# EAGLE design jnz-rev1 (EAGLE 7.5.0)
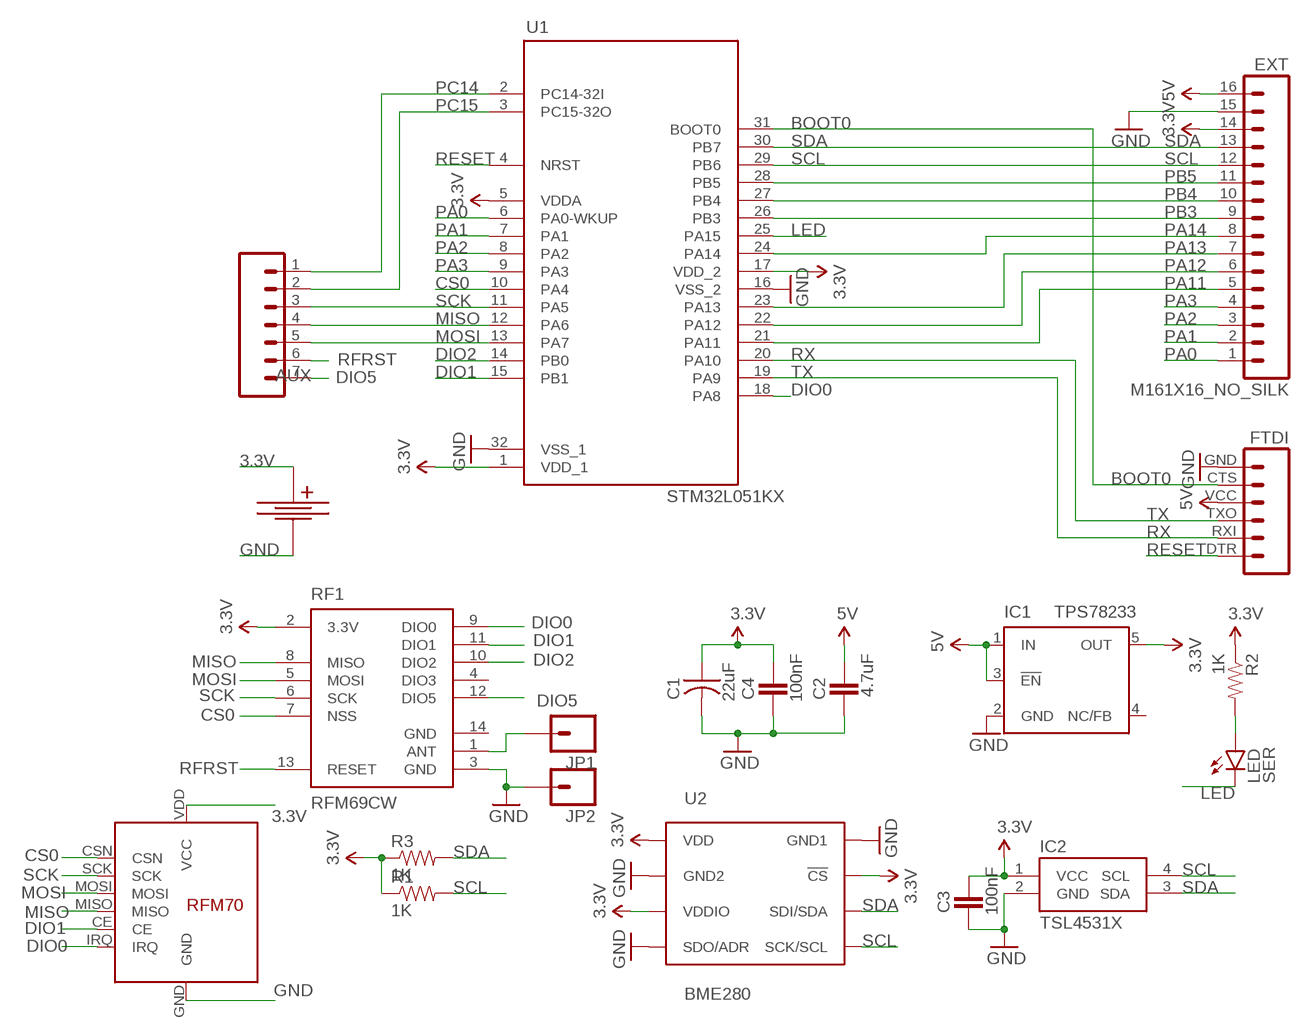
[diagram p0: schematic, sheet 1]

## Parts
AUX  M07  [1X07]
C1  22uF  C-USC0805  [C0805]
C2  4.7uF  C-EUC0805K  [C0805K]
C3  100nF  C-EUC0603K  [C0603K]
C4  100nF  C-EUC0603K  [C0603K]
EXT  M161X16_NO_SILK  [1X16_NO_SILK]
FTDI  FTDI_BASICPTH  [FTDI_BASIC]
IC1  TPS78233  TPS77001  [SOT23-DBV]
IC2  TSL4531X  [AMS_CL]
JP1  M01NOSILK-KIT  [1X01NS-KIT]
JP2  M01NOSILK-KIT  [1X01NS-KIT]
LED  SER  LED0603  [LED-0603]
R1  1K  RESISTOR0603-RES  [0603-RES]
R2  1K  RESISTOR0603-RES  [0603-RES]
R3  1K  RESISTOR0603-RES  [0603-RES]
RF1  RFM69CW  [RFM69CW-XXXS2]
RF2  RFM7x  RFM70  [RFM70]
U1  STM32L051KX  [TQFP32-08]
U2  BME280  [BME280_LGA]
U$2  CR2032-SMD  [CR2032-SMD]

## Nets
3.3V [power]: C1.1 C3.1 C4.1 EXT.14 IC1.5(OUT) IC2.1(VCC) R1.1 R2.1 R3.1 RF1.2(3.3V) RF2.VDD(VCC) U1.1(VDD_1) U1.5(VDDA) U1.17(VDD_2) U2.P$2(!CS) U2.P$6(VDDIO) U2.P$8(VDD) U$2.POS(+)
5V [power]: C2.1 EXT.16 FTDI.VCC IC1.1(IN) IC1.3(!EN)
BOOT0: FTDI.CTS U1.31(BOOT0)
CS0: RF1.7(NSS) RF2.CSN U1.10(PA4)
DIO0: RF1.9(DIO0) RF2.IRQ U1.18(PA8)
DIO1: RF1.11(DIO1) RF2.CE U1.15(PB1)
DIO2: RF1.10(DIO2) U1.14(PB0)
DIO5: AUX.7 RF1.12(DIO5)
GND [power]: C1.2 C2.2 C3.2 C4.2 EXT.15 FTDI.GND IC1.2(GND) IC2.2(GND) JP2.1 RF1.3(GND) RF2.GND U1.16(VSS_2) U1.32(VSS_1) U2.P$1(GND1) U2.P$5(SDO/ADR) U2.P$7(GND2) U$2.NEG(-)
LED: LED.C U1.25(PA15)
MISO: AUX.4 RF1.8(MISO) RF2.MISO U1.12(PA6)
MOSI: AUX.5 RF1.5(MOSI) RF2.MOSI U1.13(PA7)
N$2: LED.A R2.2
N$13: JP1.1 RF1.1(ANT)
PA0: EXT.1 U1.6(PA0-WKUP)
PA1: EXT.2 U1.7(PA1)
PA2: EXT.3 U1.8(PA2)
PA3: EXT.4 U1.9(PA3)
PA11: EXT.5 U1.21(PA11)
PA12: EXT.6 U1.22(PA12)
PA13: EXT.7 U1.23(PA13)
PA14: EXT.8 U1.24(PA14)
PB3: EXT.9 U1.26(PB3)
PB4: EXT.10 U1.27(PB4)
PB5: EXT.11 U1.28(PB5)
PC14: AUX.1 U1.2(PC14-32I)
PC15: AUX.2 U1.3(PC15-32O)
RESET: FTDI.DTR U1.4(NRST)
RFRST: AUX.6 RF1.13(RESET)
RX: FTDI.TXO U1.20(PA10)
SCK: AUX.3 RF1.6(SCK) RF2.SCK U1.11(PA5)
SCL: EXT.12 IC2.4(SCL) R1.2 U1.29(PB6) U2.P$4(SCK/SCL)
SDA: EXT.13 IC2.3(SDA) R3.2 U1.30(PB7) U2.P$3(SDI/SDA)
TX: FTDI.RXI U1.19(PA9)
Unconnected: IC1.4(NC/FB) RF1.4(DIO3)

## Power pins joined to a net without a drawn wire
GND: RF1.14(GND)

## Library data of the parts
AUX = SparkFun-Connectors:M07: Header 7 Standard 7-pin 0.1" header. Use with straight break away headers (SKU : PRT-00116), right angle break away headers (PRT-00553), swiss pins (PRT-00743), machine pins (PRT-00117), and female headers (PRT-00115). NOTES ON THE VARIANTS LOCK and LOCK_LONGPADS... This footprint was designed to help hold the alignment of a through-hole component (i.e. 7-pin header) while soldering it into place. You may notice that each hole has been shifted either up or down by 0.005 of an inch from it's more standard position (which is usually a perfectly straight line). This slight alteration caused the pins (the squares in the middle) to touch the edges of the holes. Because they are alternating, it causes a "brace" to hold the header in place. 0.005 has proven to be the perfect amount of "off-center" position when using our standard breakaway headers. Although looks a little odd when you look at the bare footprint, once you have a header in there, the alteration is very hard to notice. Also, if you push a header all the way into place, it is covered up entirely on the bottom side. This idea of altering the position of holes to aid alignment will be further integrated into the Sparkfun Library for other footprints. It can help hold any component with 3 or more connection pins.
C1 = resistor:C-US: CAPACITOR, American symbol
C2-C4 = rcl:C-EU: CAPACITOR, European symbol
EXT = SparkFun-Connectors:M16: 1x16 .1" header
FTDI = SparkFun-Connectors:FTDI_BASIC: FTDI Basic header with labels
IC1 = texas:TPS770*: ULTRALOW-POWER 50-mA LOW-DROPOUT LINEAR REGULATORS 50-mA Low-Dropout Regulator Source: http://focus.ti.com/lit/ds/symlink/tps77001.pdf; MF: TEXAS INSTRUMENTS; MPN: TPS77001DBVT; OC_FARNELL: 8461554; OC_NEWARK: 77C1171
IC2 = we-sensor:TSL4531X: AMS TSL4531 I2C Ambient Light Sensor
JP1 JP2 = SparkFun-Connectors:M01: Header 1 Standard 1-pin 0.1" header. Use with straight break away headers (SKU : PRT-00116), right angle break away headers (PRT-00553), swiss pins (PRT-00743), machine pins (PRT-00117), and female headers (PRT-00115).
LED = SparkFun-LED:LED: LEDs Standard schematic elements and footprints for 5mm, 3mm, 1206, and 0603 sized LEDs. 5mm - Spark Fun Electronics SKU : COM-00529 (and others)
R1-R3 = SparkFun-Passives:RESISTOR: Resistor Basic schematic elements and footprints for 0603, 1206, and PTH resistors.
RF1 = SparkFun-RF:RFM69
RF2 = JeeLabs:RFM70
U1 = JeeLabs:STM32L051KX
U2 = BME280ComponentLibrary:BME280; PROD_ID: IC-13090
U$2 = tve-parts:CR2032-SMD

## Net classes
1 power: width 0.203 mm

## Board
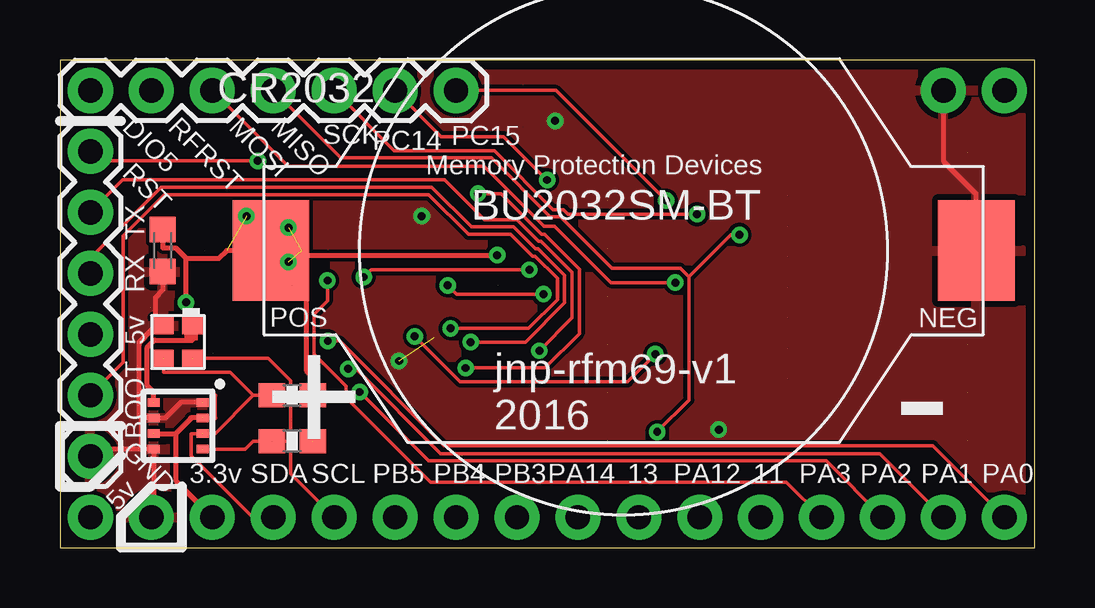
[diagram p1: board, top side]
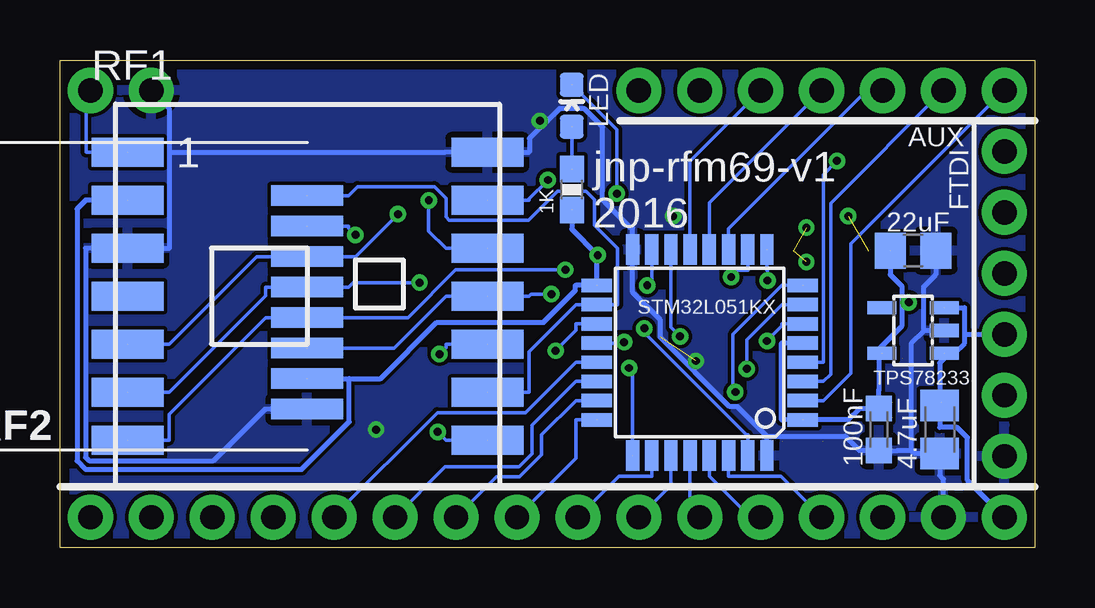
[diagram p2: board, bottom side, seen from below]

Size 40.64 x 20.32 mm. Coordinates in mm from the lower left corner, seen from the top.
Outline: 0,0 40.64,0 40.64,20.32 0,20.32 0,0
Copper layers (1*16): Top 0.0356mm / dielectric 1.5011mm / Bottom 0.0356mm
Design rules "ComboDRU *": minimum track width 6mil, minimum drill 13mil, track to track 6mil, track to pad 6mil, pad to pad 6mil, via to via 6mil, smd to smd 6mil, copper to edge 15mil, drill to drill 10mil, minimum pad ring 10mil, minimum via ring 7mil, stop-mask expansion 3mil, vias tented up to drill 20mil, thermal gap 10mil

### Footprints (pad centres in the part's own frame; a part is rotated, then mirrored left to right if it is on the bottom)
1X07 = drill 1.016 pad 1.88: 1 0,0; 2 2.54,0; 3 5.08,0; 4 7.62,0; 5 10.16,0; 6 12.7,0; 7 15.24,0
C0805 = smd 1.3 x 1.5: 1 -0.95,0; 2 0.95,0
C0805K = smd 1.3 x 1.6: 1 -1,0; 2 1,0
C0603K = smd 1.05 x 1.08: 1 -0.875,0; 2 0.875,0
1X16_NO_SILK = drill 1.016 pad 1.88: 1 0,0; 2 2.54,0; 3 5.08,0; 4 7.62,0; 5 10.16,0; 6 12.7,0; 7 15.24,0; 8 17.78,0; 9 20.32,0; 10 22.86,0; 11 25.4,0; 12 27.94,0; 13 30.48,0; 14 33.02,0; 15 35.56,0; 16 38.1,0
FTDI_BASIC = drill 1.016 pad 1.88: CTS 10.16,0; DTR 0,0; GND 12.7,0; RXI 2.54,0; TXO 5.08,0; VCC 7.62,0
SOT23-DBV = smd 0.55 x 1.2: 1 -0.95,-1.3; 2 0,-1.3; 3 0.95,-1.3; 4 0.95,1.3; 5 -0.95,1.3
AMS_CL = smd 0.7 x 0.85: 1 -0.675,0.6; 2 -0.675,-0.6; 3 0.675,-0.6; 4 0.675,0.6
1X01NS-KIT = drill 1.016 pad 1.88: 1 0,0
LED-0603 = smd 1 x 1: A 0,-0.877; C 0,0.877
0603-RES = smd 1.1 x 1: 1 -0.85,0; 2 0.85,0
RFM69CW-XXXS2 = smd 3 x 1.2: 1 -7.5,6; 2 -7.5,4; 3 -7.5,2; 4 -7.5,0; 5 -7.5,-2; 6 -7.5,-4; 7 -7.5,-6; 8 7.5,-6; 9 7.5,-4; 10 7.5,-2; 11 7.5,0; 12 7.5,2; 13 7.5,4; 14 7.5,6
RFM70 = smd 3 x 0.85: CE -8.4,2.16; CSN -8.4,0.89; GND -8.4,4.7; IRQ -8.4,-4.19; MISO -8.4,-2.92; MOSI -8.4,-1.65; SCK -8.4,-0.38; VDD -8.4,3.43
TQFP32-08 = smd 1.27 x 0.559: 1 -4.293,2.8; 2 -4.293,2; 3 -4.293,1.2; 4 -4.293,0.4; 5 -4.293,-0.4; 6 -4.293,-1.2; 7 -4.293,-2; 8 -4.293,-2.8; 17 4.293,-2.8; 18 4.293,-2; 19 4.293,-1.2; 20 4.293,-0.4; 21 4.293,0.4; 22 4.293,1.2; 23 4.293,2; 24 4.293,2.8 | smd 0.559 x 1.27: 9 -2.8,-4.293; 10 -2,-4.293; 11 -1.2,-4.293; 12 -0.4,-4.293; 13 0.4,-4.293; 14 1.2,-4.293; 15 2,-4.293; 16 2.8,-4.293; 25 2.8,4.293; 26 2,4.293; 27 1.2,4.293; 28 0.4,4.293; 29 -0.4,4.293; 30 -1.2,4.293; 31 -2,4.293; 32 -2.8,4.293
BME280_LGA = smd 0.5 x 0.35: P$1 1.025,0.975; P$2 1.025,0.325; P$3 1.025,-0.325; P$4 1.025,-0.975; P$5 -1.025,-0.975; P$6 -1.025,-0.325; P$7 -1.025,0.325; P$8 -1.025,0.975
CR2032-SMD = smd 3.2 x 4.2: NEG 14.7,0; POS -14.7,0

### Placement (x,y rotation side)
AUX  1.27,19.05 0 top
C1  5.08,12.38 0 bottom
C2  3.97,4.92 270 bottom
C3  4.29,12.38 270 top
C4  6.51,4.92 270 bottom
EXT  39.37,1.27 180 top
FTDI  1.27,16.51 270 top
IC1  5.08,9.05 90 bottom
IC2  4.92,8.57 270 top
JP1  39.37,19.05 0 top
JP2  36.83,19.05 0 top
LED  19.3,18.41 0 bottom
R1  9.68,4.45 180 top
R2  19.3,14.92 90 bottom
R3  9.68,6.35 180 top
RF1  30.32,10.48 0 bottom
RF2  38.73,10.48 180 bottom
U1  13.97,8.13 180 bottom
U2  4.92,5.08 0 top
U$2  23.5,12.38 0 top

### Tracks (layer width: path | path; a pad name or v marks a point on that pad's centre or on a via)
3.3V  (via drill 0.33, 0.33 pad 0.69)  (15 unrouted)
  Top 0.203: 10.26,12.19 v18.22,12.19 | 10.26,12.19 10.26,7.38 10.53,7.1 R3.1 R1.1 | 10.26,12.19 10.07,12.38 U$2.POS 6.94,12.38 6.62,12.06 5.26,12.06 | 5.26,12.06 4.84,12.48 4.29,12.48 C3.1 | 5.26,12.06 v5.26,10.22 5.26,10.12 5.52,9.85 IC2.1 5.52,8.64 3.93,8.64 3.64,8.35 3.64,6.74 3.9,6.48 | 4.83,4.76 4.83,2.79 EXT.14 | U2.P$6 4.83,4.76 | 4.83,4.76 5.44,5.37 5.44,5.4 U2.P$2 5.98,5.4 6.45,5.4 6.45,6.34 6.3,6.48 3.9,6.48 | U2.P$8 3.9,6.48
  Bottom 0.203: R2.1 19.3,13.27 v18.22,12.19 18.26,12.15 U1.17 19.15,10.93 19.15,10.72 20.48,9.39 24.93,9.39 27.27,7.05 28.58,7.05 | U1.5 10.57,8.53 10.57,5.33 U1.1 7.77,5.33 7.3,5.8 C4.1 6.51,6.57 6.5,6.58 6.5,8.1 | 6.5,8.1 6.68,8.1 IC2.1 5.53,10.22 | IC1.5 6.5,8.1 | 5.53,10.22 5.53,10.87 6.03,11.38 C1.1 | 5.53,10.22 v5.26,10.22 | 28.58,7.05 28.58,5.24 30.56,3.27 39.58,3.27 39.93,3.62 39.93,14.12 39.57,14.48 RF1.2 | RF2.VDD 28.58,7.05
  other vias: 7.78,13.81 9.53,13.34 9.53,11.91
5V  (2 unrouted)
  Bottom 0.203: EXT.16 2.81,2.81 2.81,4.58 3.25,5.02 3.97,5.02 C2.1 3.97,7.7 3.57,8.1 | 3.57,8.1 3.35,8.1 2.93,8.53 2.93,8.89 | IC1.1 3.57,8.1 | IC1.3 2.93,10 | 2.93,8.89 2.93,10 | 2.93,10 | 2.93,8.89 FTDI.VCC
BOOT0  (via drill 0.33 pad 0.69)
  Top 0.152: FTDI.CTS 2.64,7.72 2.64,13.01 4.35,14.71 15.37,14.71 17.03,13.06 18.79,13.06 19.7,12.15 19.81,12.15 20.73,11.23 20.73,10.33 19.54,9.13 v16.28,9.13
  Bottom 0.152: v16.28,9.13 16.28,8.96 12.02,4.7 11.97,4.7 U1.31
CS0  (via drill 0.33 pad 0.69)  (2 unrouted)
  Top 0.152: v12.66,11.28 12.96,11.58 v19.57,11.58
  Bottom 0.152: U1.10 11.97,11.56 12.38,11.56 v12.66,11.28 | RF1.7 36.09,4.48 36.09,5.56 32.06,9.59 RF2.CSN 26.14,9.59 24.14,11.58 v19.57,11.58
DIO0  (2 unrouted)
  Bottom 0.152: RF2.IRQ 28.61,14.67 28.23,15.04 25.03,15.04 24.55,14.56 24.55,13.78 24.42,13.65 21.11,13.65 19.91,14.85 18.7,14.85 18.35,14.5 18.35,13.43 17.4,12.48 17.4,10.13 U1.18 18.62,10.13 19.13,10.13 21.09,8.16 21.09,6.48 RF1.9
DIO1  (via drill 0.33 pad 0.69)  (2 unrouted)
  Top 0.152: v16.16,10.93 16.53,10.56 v20.16,10.56
  Bottom 0.152: U1.15 15.97,11.12 v16.16,10.93 | v20.16,10.56 21.01,10.56 21.09,10.48 RF1.11 24.55,10.48 26.71,8.32 RF2.CE
DIO2  (via drill 0.33 pad 0.69)  (1 unrouted)
  Top 0.152: v14.79,8.8 16.68,6.91 23.66,6.91 v24.82,8.07
  Bottom 0.152: U1.14 15.17,9.18 v14.79,8.8 | v24.82,8.07 24.55,8.34 24.55,8.48 RF1.10
DIO5  (via drill 0.33 pad 0.69)  (1 unrouted)
  Top 0.152: v25.27,14.47 20.68,19.05 AUX.7
  Bottom 0.152: RF1.12 24.55,12.48 25.27,13.19 v25.27,14.47
GND  (via drill 0.33)  (2 unrouted)
  Top 0.203: U$2.NEG 38.2,14.74 36.83,16.1 JP2.1 | 3.39,4.11 1.56,4.11 FTDI.GND | 3.39,5.4 3.39,4.11 | 3.98,9.25 3.28,8.55 3.28,5.52 3.39,5.4 | 3.39,4.11 U2.P$5 3.9,1.36 EXT.15 | 3.98,9.25 3.98,10.42 4.29,10.73 C3.2 | 3.39,5.4 U2.P$7 3.95,5.4 4.4,5.4 5.05,6.05 U2.P$1 | IC2.2 3.98,9.25
  Bottom 0.203: 4.63,9.05 4.63,10.87 4.13,11.38 C1.2 | 5.15,4.05 5.15,8.54 4.63,9.05 | 5.15,4.05 5.71,4.05 C4.2 7.3,4.05 7.91,4.65 11.17,4.65 | 5.15,4.05 5.02,3.92 C2.2 3.97,3.02 3.81,2.86 EXT.15 | IC1.2 4.63,9.05 | 11.17,4.65 12.39,5.87 12.72,5.87 15.61,8.76 15.61,9.5 16.77,10.65 U1.16 16.77,13.31 16.83,13.31 18.02,14.51 18.02,17.53 18.78,18.29 19.83,18.29 21.07,17.05 21.07,16.48 RF1.14 23.53,16.48 23.7,16.48 24.57,16.48 36.07,16.48 | U1.32 11.17,4.65 | RF2.GND 32.09,5.78 34.24,3.62 39.43,3.62 39.57,3.77 39.57,12.48 RF1.3 36.07,12.48 36.07,16.48 | 36.07,16.48 36.07,18.29 JP2.1
  other vias: 27.46,4.92 14.13,7.78 15.08,13.81 20.64,17.78
  pour Top: -2.54,-2.54 -2.54,21.59 43.18,21.59 43.18,-2.54
  pour Bottom: -1.27,-1.27 -1.27,22.86 41.91,22.86 41.91,-1.27
LED  (via drill 0.33 pad 0.69)  (2 unrouted)
  Top 0.152: v17.43,14.75 18.39,14.75 20.07,13.07 20.19,13.07 21.65,11.6 21.65,8.92 20.22,7.49 v16.91,7.49
  Bottom 0.152: U1.25 16.77,7.35 v16.91,7.49 | v17.43,14.75 17.43,17.41 LED.C
MISO  (via drill 0.33 pad 0.69)  (2 unrouted)
  Top 0.152: 26.22,11.28 25.86,11.65 23,11.65 20.87,13.79 20.43,13.79 17.98,16.24 11.7,16.24 AUX.4 | v24.9,4.82 26.22,6.15 26.22,11.28 | v28.32,13.03 27.98,13.03 26.22,11.28
  Bottom 0.152: RF2.MISO 28.61,13.4 28.61,13.32 v28.32,13.03 | v24.9,4.82 24.55,4.48 RF1.8 | U1.12 13.57,14.37 AUX.4
MOSI  (via drill 0.33 pad 0.69)  (2 unrouted)
  Top 0.152: v26.55,13.9 21.19,13.9 20.99,14.09 20.56,14.09 18.11,16.54 13.94,16.54 AUX.5
  Bottom 0.152: v26.55,13.9 28.32,12.13 28.61,12.13 29.47,12.13 RF2.MOSI 32.44,12.13 36.09,8.48 RF1.5 | U1.13 14.37,16.11 AUX.5
N$2  (2 unrouted)
  Bottom 0.152: R2.2 LED.A
N$13  (1 unrouted)
  Bottom 0.152: RF1.1 39.55,16.48 39.55,18.87 JP1.1
PA0  (via drill 0.33 pad 0.69)
  Top 0.152: EXT.1 36.39,4.25 16.02,4.25 11.66,8.61 v11.17,8.61
  Bottom 0.152: U1.6 10.54,9.33 10.54,9.24 v11.17,8.61
PA1  (via drill 0.33 pad 0.69)
  Top 0.152: EXT.2 34.18,3.92 15.87,3.92 12.34,7.45 v12.01,7.45
  Bottom 0.152: U1.7 10.54,10.13 12.01,8.66 v12.01,7.45
PA2  (via drill 0.33 pad 0.69)  (1 unrouted)
  Top 0.152: v12.49,6.49 15.37,3.61 31.95,3.61 EXT.3
  Bottom 0.152: U1.8 10.54,10.93 12.58,8.89 12.58,6.58 v12.49,6.49
PA3  (via drill 0.33 pad 0.69)  (1 unrouted)
  Top 0.152: v11.15,11.13 11.15,10.29 10.6,9.74 10.6,8.05 11.92,6.73 11.92,6.25 15.44,2.73 30.29,2.73 EXT.4
  Bottom 0.152: v11.15,11.13 11.15,11.54 11.17,11.56 U1.9
PA11
  Bottom 0.152: EXT.5 29.21,1.32 24.91,5.62 21.23,5.62 19.13,7.73 U1.21
PA12
  Bottom 0.152: U1.22 19.13,6.93 20.96,5.1 20.96,3.91 21.5,3.36 24.58,3.36 EXT.6
PA13
  Bottom 0.152: EXT.7 22.45,2.95 21.49,2.95 20.56,3.88 20.56,4.7 19.13,6.13 U1.23
PA14  (1 unrouted)
  Bottom 0.152: U1.24 19.13,5.33 19.13,3.73 EXT.8
PB3
  Bottom 0.152: U1.26 15.97,2.97 17.35,2.97 EXT.9
PB4
  Bottom 0.152: U1.27 15.17,2.61 EXT.10
PB5
  Bottom 0.152: U1.28 14.37,1.67 EXT.11
PC14
  Bottom 0.152: U1.2 8.81,6.13 7.66,7.28 7.66,12.66 AUX.1
PC15
  Bottom 0.152: AUX.2 8.51,14.35 8.51,7.23 8.81,6.93 U1.3
RESET  (via drill 0.33 pad 0.69)
  Top 0.152: v8.25,16.11 1.67,16.11 FTDI.DTR
  Bottom 0.152: U1.4 8.81,7.73 8.81,15.55 v8.25,16.11
RFRST  (via drill 0.33 pad 0.69)  (1 unrouted)
  Top 0.152: v20.3,15.32 18.49,17.13 15.89,17.13 AUX.6
  Bottom 0.152: RF1.13 21.09,14.48 21.09,14.53 v20.3,15.32
RX  (via drill 0.33 pad 0.69)
  Top 0.152: FTDI.TXO 1.27,12.07 4.22,15.02 15.5,15.02 17.15,13.36 18.92,13.36 19.82,12.46 19.94,12.46 21.04,11.36 21.04,10.2 19.4,8.56 v17.12,8.56
  Bottom 0.152: U1.20 17.16,8.53 v17.12,8.56
SCK  (via drill 0.33 pad 0.69)  (2 unrouted)
  Top 0.152: AUX.3 9.51,15.89 17.68,15.89 20.19,13.38 20.62,13.38 22.96,11.04 v25.65,11.04
  Bottom 0.152: v25.65,11.04 28.42,11.04 28.61,10.86 RF2.SCK 32.06,10.86 32.06,10.51 36.09,6.48 RF1.6 | AUX.3 7,19.05 12.77,13.28 U1.11
SCL  (3 unrouted)
  Top 0.152: EXT.12 9.61,3.09 9.61,4.45 | 9.61,4.45 R1.2 8.05,4.45 7.71,4.11 U2.P$4 | 9.61,4.45 9.61,6.95 8.67,7.9 6.18,7.9 IC2.4
  Bottom 0.152: U1.29 13.57,2.97 11.87,1.27 EXT.12
SDA  (3 unrouted)
  Top 0.152: EXT.13 8.03,1.27 5.47,3.83 5.47,4.76 U2.P$3 6.46,4.76 8.05,6.35 | 8.05,6.35 7.09,7.32 4.32,7.32 IC2.3 | R3.2 8.05,6.35
  Bottom 0.152: EXT.13 10.59,2.97 12.77,2.97 U1.30
TX  (via drill 0.33 pad 0.69)
  Top 0.152: FTDI.RXI 2.62,15.32 16.04,15.32 17.7,13.67 19.04,13.67 19.95,12.76 20.06,12.76 21.35,11.48 21.35,9.57 v19.98,8.21
  Bottom 0.152: U1.19 19.13,9.33 19.13,9.06 v19.98,8.21

### Text on the board
tNames: DIO5 | RFRST | MOSI | MISO | SCK | PC14 | PC15 | RST | TX | RX | 5v | NEG | POS | BOOT | jnp-rfm69-v1 / 2016 | GND | 3.3v | SDA | SCL | PB5 | PB4 | PB3 | PA14 | 13 | PA12 | 11 | PA3 | PA2 | PA1 | PA0 | 5v
bNames: jnp-rfm69-v1 / 2016